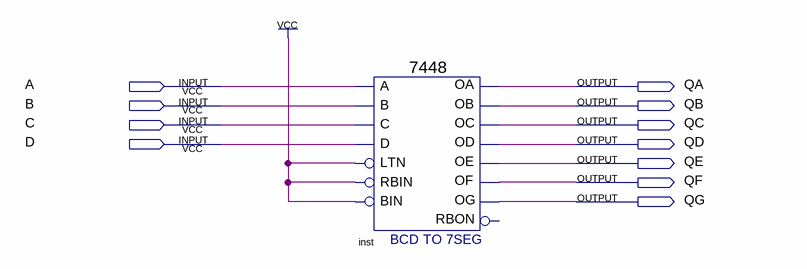
[diagram p0: schematic sheet]
// Quartus schematic Block5.bdf as structural Verilog: 1 symbols, 11 pins
module Block5 (
  input  A,
  input  B,
  input  C,
  input  D,
  output QA,
  output QB,
  output QC,
  output QD,
  output QE,
  output QF,
  output QG
);

  \7448  inst (
    .A(A), .C(C), .D(D), .B(B), .RBIN(1'b1), .BIN(1'b1), .LTN(1'b1), .OC(QC), .OE(QE), .OD(QD), .OF(QF),
    .OG(QG), .OB(QB), .OA(QA));  // open: RBON
endmodule
